# Altium schematic sheet as5311_tsb.SchDoc
size A4; SheetNumber: 1; SheetTotal: 1
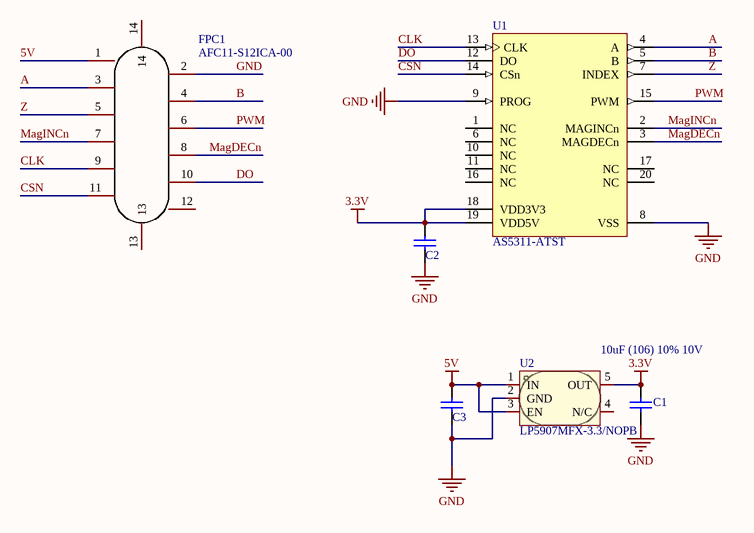
[diagram p0: as5311_tsb.SchDoc]

## Parts
C1  10uF (106) 10% 10V  [0603_C]
C2  100nF (104) 10% 50V  [0603_C]  (value not drawn)
C3  100nF (104) 10% 50V  [0603_C]  (value not drawn)
FPC1  AFC11-S12ICA-00  [CONN-SMD-12P_AFC11-S12ICA-00]
U1  AS5311-ATST  [AMS-TSSOP-20-6500X4400DE_A_L]
U2  LP5907MFX-3.3/NOPB  [SOT-23-5_L3.0-W1.7-P0.95-LS2.8-BR]

## Nets
3.3V: C1.2 C2.2 U1.18(VDD3V3) U1.19(VDD5V) U2.5(OUT)
5V: C3.2 FPC1.1 U2.1(IN) U2.3(EN)
GND: C1.1 C2.1 C3.1 FPC1.2 U1.8(VSS) U1.9(PROG) U2.2(GND)
A: FPC1.3 U1.4(A)
B: FPC1.4 U1.5(B)
CLK: FPC1.9 U1.13(CLK)
CSN: FPC1.11 U1.14(CSn)
DO: FPC1.10 U1.12(DO)
MagDECn: FPC1.8 U1.3(MAGDECn)
MagINCn: FPC1.7 U1.2(MAGINCn)
PWM: FPC1.6 U1.15(PWM)
Z: FPC1.5 U1.7(INDEX)

Not connected (* = marked no-connect by the designer): FPC1 12 13 14; U1 1(NC) 6(NC) 10(NC) 11(NC) 16(NC) 17(NC) 20(NC); U2 4(N/C)

## Library data of the parts
C1 = 0603 10uF (106) 10% 10V: 贴片电容; ComponentLink1Description: 供应商链接; ComponentLink1URL: http://www.szlcsc.com/product/details_20411.html; Package: 0603; Supplier: LC; SuppliersPartNumber: C19702
C2 C3 = 0603 100nF (104) 10% 50V: 贴片电容; ComponentLink1Description: 供应商链接; ComponentLink1URL: http://www.szlcsc.com/product/details_15331.html; Package: 0603; Supplier: LC; SuppliersPartNumber: C14663
FPC1 = FPC-12PIN-0.5-立贴: AFC11-S12ICA-00，间距:0.5mm;触点数量:12P;锁定特性:抽屉式;触点类型:单侧触点/垂直;安装类型:立贴;; Manufacturer: JS(钜硕电子); Add into BOM: yes; Pitch: 0.5mm; Number of Contacts: 12P; Locking Feature: 抽屉式; FFC, FCB Thickness: 0.3mm; Symbol: AFC11-S12ICA-00; Device: AFC11-S12ICA-00; LCSC Part Name: 间距:0.5mm P数:12P 抽屉式 单侧触点/垂直 正脚; Supplier Part: C262499; Manufacturer Part: AFC11-S12ICA-00; Supplier Footprint: SMD,P=0.5mm; JLCPCB Part Class: 扩展库; Datasheet: https://atta.szlcsc.com/upload/public/pdf/source/20191211/C466537_F6F2472ADACFFA77E875AFE9DAB8E0AD.pdf; Supplier: LCSC; Convert to PCB: yes; Contact Type: 单侧触点/垂直; Mounting Type: 立贴; Height Above Board: 4.4mm; Name: AFC11-S12ICA-00
U1 = AS5311: 12-bit Linear Incremental Position Sensor with Digital Interface, 3.3 or 5 V, TSSOP-20, Pb-Free, Reel; Manufacturer: AMS; Manufacturer: ams TAOS; Resolution: 0.488 Âµm absolute 1.95 Âµm incremental; Output: incremental A & B with index; absolute serial + PWM output; Supply Voltage (V): 3.3 or 5.0; ComponentLink2Description: Datasheet; PartNumber: AS5311-ATST; PackageDescription: 20-Pin Thin Shrink Small Outline Package, 6.5 x 4.4 mm Body, 0.65 mm Pitch; PackageVersion: Rev. 1.9, 11/2012; ComponentLink1URL: www.ams.com; ComponentLink1Description: Manufacturer URL; ComponentLink2URL: http://www.ams.com/eng/content/download/17954/325059/15366; DatasheetVersion: Rev. 1.12; PackageReference: TSSOP-20; Mounting Technology: Surface Mount; Features: high resolution, linear movement measurement using multi-pole magnetic strips, circular off-axis movement measurement using multi-pole magnetic rings; Manufacturer Part Number: AS5311-ATST
U2 = LP5907MFX-3.3/NOPB: 输出类型:固定;输出极性:正;最大输入电压:5.5V;输出电压:3.3V;输出电流:250mA;电源纹波抑制比(PSRR):90dB;; Manufacturer: TI(德州仪器); Add into BOM: yes; Output Type: 固定; Output Polarity: 正; Number of Outputs: 1; Maximum Input Voltage: 5.5V; Output Voltage: 3.3V; Dropout Voltage: 250mV@(250mA); Quiescent Current (Ground Current): 25uA; Output Current: 250mA; Power Supply Rejection Ratio (PSRR): 90dB; Symbol: LP5907MFX-3.3/NOPB; Device: LP5907MFX-3.3/NOPB; LCSC Part Name: 输入5.5V 输出3.3V 250mA; Supplier Part: C80670; Manufacturer Part: LP5907MFX-3.3/NOPB; Supplier Footprint: SOT-23-5; JLCPCB Part Class: 扩展库; Datasheet: https://www.ti.com/cn/lit/gpn/lp5907; Supplier: LCSC; Convert to PCB: yes; Operating Temperature: -40℃~+125℃; Name: LP5907MFX-3.3/NOPB